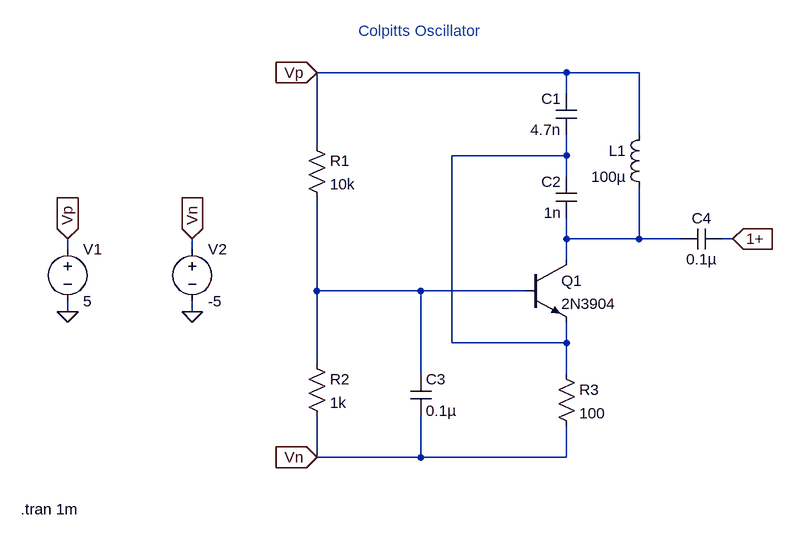
[diagram p0: schematic colpitts_osc_ltspice.asc]
colpitts_osc_ltspice.asc, the LTspice schematic file:
Version 4
SHEET 1 880 784
WIRE 464 96 80 96
WIRE 576 96 464 96
WIRE 464 128 464 96
WIRE 576 192 576 96
WIRE 80 208 80 96
WIRE 464 224 464 192
WIRE 464 224 288 224
WIRE 464 256 464 224
WIRE 464 352 464 320
WIRE 576 352 576 272
WIRE 576 352 464 352
WIRE 640 352 576 352
WIRE 720 352 704 352
WIRE -304 368 -304 352
WIRE -112 368 -112 352
WIRE 464 384 464 352
WIRE 80 432 80 288
WIRE 240 432 80 432
WIRE 400 432 240 432
WIRE -304 464 -304 448
WIRE -112 464 -112 448
WIRE 288 512 288 224
WIRE 464 512 464 480
WIRE 464 512 288 512
WIRE 80 544 80 432
WIRE 240 560 240 432
WIRE 464 560 464 512
WIRE 80 688 80 624
WIRE 240 688 240 624
WIRE 240 688 80 688
WIRE 464 688 464 640
WIRE 464 688 240 688
FLAG 720 352 1+
IOPIN 720 352 In
FLAG 80 96 Vp
IOPIN 80 96 In
FLAG 80 688 Vn
IOPIN 80 688 In
FLAG -304 464 0
FLAG -112 464 0
FLAG -304 352 Vp
IOPIN -304 352 In
FLAG -112 352 Vn
IOPIN -112 352 In
SYMBOL res 64 192 R0
SYMATTR InstName R1
SYMATTR Value 10k
SYMBOL res 64 528 R0
SYMATTR InstName R2
SYMATTR Value 1k
SYMBOL npn 400 384 R0
SYMATTR InstName Q1
SYMATTR Value 2N3904
SYMBOL res 448 544 R0
SYMATTR InstName R3
SYMATTR Value 100
SYMBOL cap 224 560 R0
SYMATTR InstName C3
SYMATTR Value 0.1µ
SYMBOL cap 704 336 R90
WINDOW 0 0 32 VBottom 2
WINDOW 3 32 32 VTop 2
SYMATTR InstName C4
SYMATTR Value 0.1µ
SYMBOL voltage -304 352 R0
WINDOW 123 0 0 Left 0
WINDOW 39 0 0 Left 0
SYMATTR InstName V1
SYMATTR Value 5
SYMBOL voltage -112 352 R0
WINDOW 123 0 0 Left 0
WINDOW 39 0 0 Left 0
SYMATTR InstName V2
SYMATTR Value -5
SYMBOL cap 480 128 M0
SYMATTR InstName C1
SYMATTR Value 4.7n
SYMBOL cap 480 256 M0
SYMATTR InstName C2
SYMATTR Value 1n
SYMBOL ind 592 176 M0
SYMATTR InstName L1
SYMATTR Value 100µ
TEXT 144 32 Left 2 ;Colpitts Oscillator
TEXT -376 768 Left 2 !.tran 1m

The netlist it stands for:
* colpitts_osc_ltspice.asc
R1 Vp N003 10k
R2 N003 Vn 1k
Q1 N002 N003 N001 0 2N3904
R3 N001 Vn 100
C3 N003 Vn 0.1µ
C4 1+ N002 0.1µ
V1 Vp 0 5
V2 Vn 0 -5
C1 Vp N001 4.7n
C2 N001 N002 1n
L1 Vp N002 100µ
.model NPN NPN
.model PNP PNP
.lib standard.bjt
* Colpitts Oscillator
.tran 1m
.backanno
.end